# EasyEDA schematic 1-Schematic_simple_slew_limiter.json
TITLE: Sheet_1; REV: 1.0; Date: 2025-02-18; Sheet: 1/1; Drawn By: t.friedrich-soehner; Company: Your Company
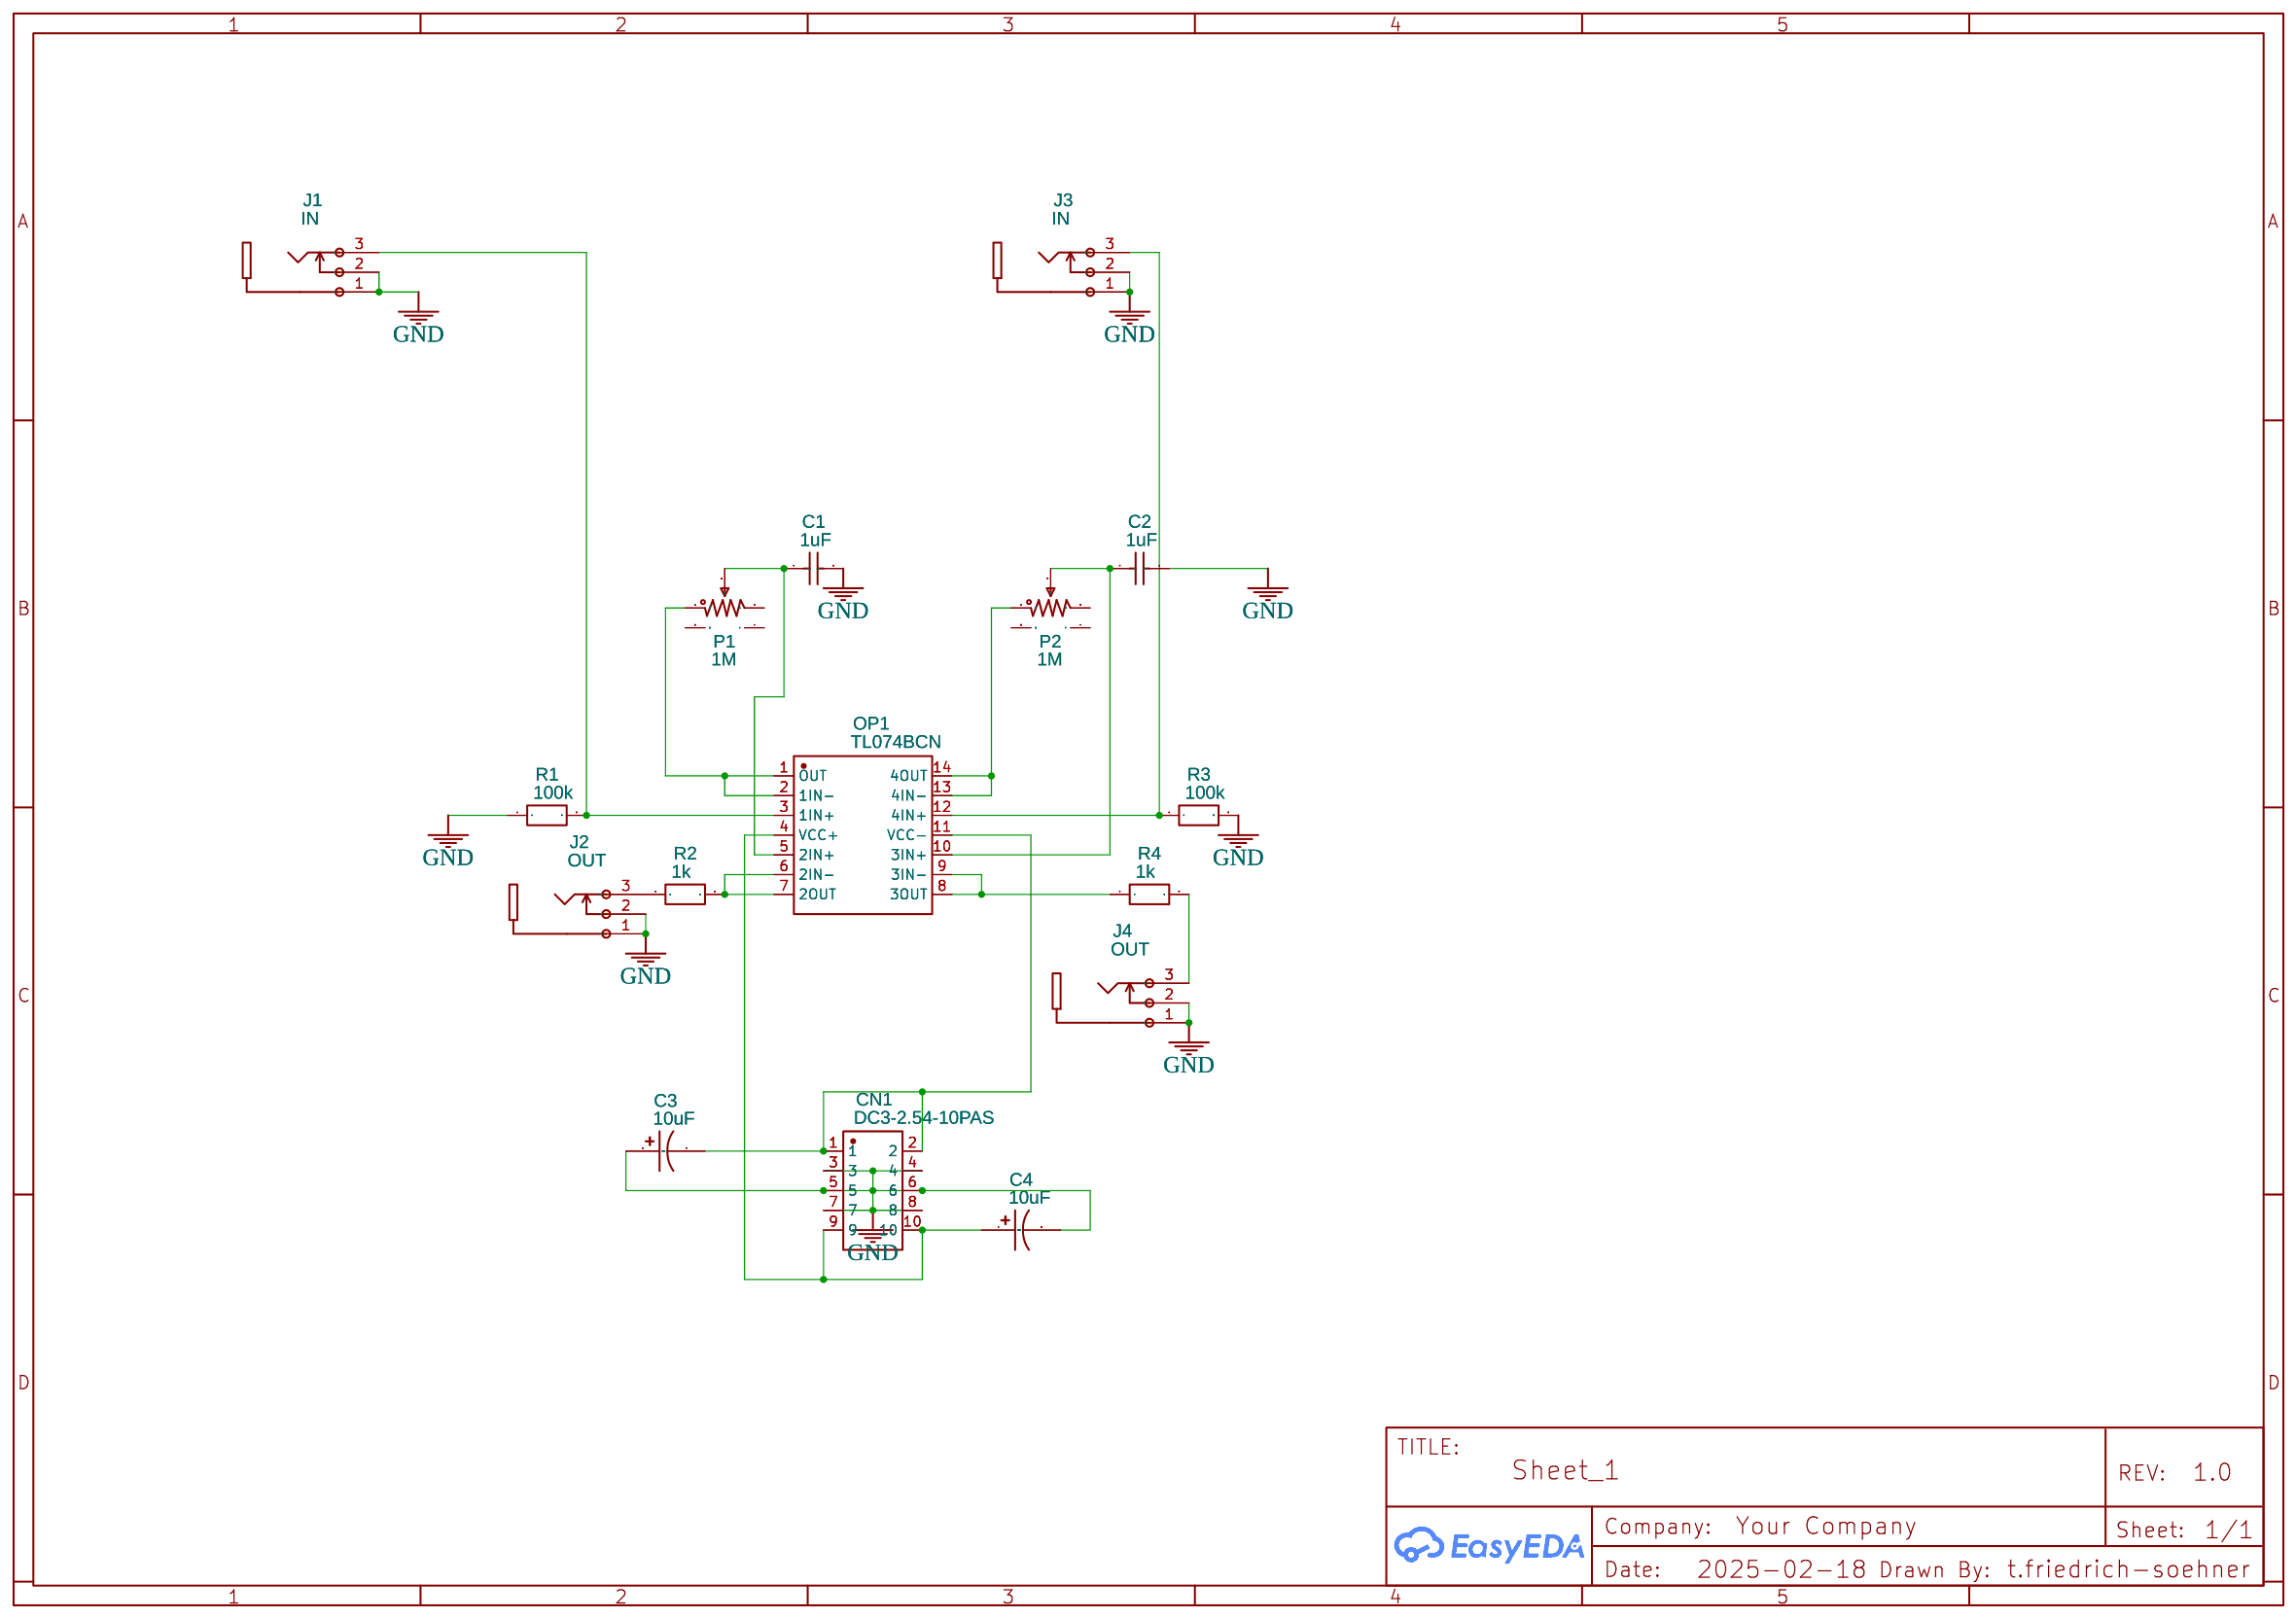
[diagram p0: schematic sheet]

## Parts
C1  1uF  [CAP-2.5*6.5*7.2]
C2  1uF  [CAP-2.5*6.5*7.2]
C3  10uF  [CAP-TH_BD5.0-P2.00-D0.5-FD]
C4  10uF  [CAP-TH_BD5.0-P2.00-D0.5-FD]
CN1  DC3-2.54-10PAS  [CONN-TH_10P-P2.54_DC3-2.54-10PAS]
J1  IN  [PJ-301M]
J2  OUT  [PJ-301M]
J3  IN  [PJ-301M]
J4  OUT  [PJ-301M]
OP1  TL074BCN  [PDIP-14_L19.3-W6.5-P2.54-LS7.6-BL]
P1  1M  [RES-TH_RK09K1130AAU]
P2  1M  [RES-TH_RK09K1130AAU]
R1  100k  [RES-TH_BD2.4-L6.3-P10.30-D0.6]
R2  1k  [RES-TH_BD2.4-L6.3-P10.30-D0.6]
R3  100k  [RES-TH_BD2.4-L6.3-P10.30-D0.6]
R4  1k  [RES-TH_BD2.4-L6.3-P10.30-D0.6]

## Library data of the parts
C1 C2 = 0.22uF 5% 100VCalibration capacitor: Supplier Part: undefined; Supplier: LCSC; Manufacturer: ReliaPro
C3 C4 = 50MS710MEFCTZ5X7: Contributor: lcsc; Supplier: LCSC; Supplier Part: C5115261; Manufacturer: rubycon(红宝石)
CN1 = DC3-2.54-10PAS: Contributor: lcsc; Supplier: LCSC; Supplier Part: C2977596; Manufacturer: ZHOURI(洲日); JLCPCB Part Class: Extended Part
J1-J4 = PJ-301M: Supplier: Various; Contributor: Ed Random
OP1 = TL074BCN: Contributor: LCSC; Supplier: LCSC; Supplier Part: C1346542; Manufacturer: TI(德州仪器); JLCPCB Part Class: Extended Part
P1 P2 = RK09K1130081: Supplier: LCSC; Supplier Part: C470311; Manufacturer: ALPSALPINE(阿尔卑斯阿尔派); JLCPCB Part Class: Extended Part; Contributor: lcsc
R1-R4 = Res_AXIAL-0.4(1/4W)_US

## Nets
GND: C1.2 C2.2 C3.1 C4.2 CN1.3 CN1.4 CN1.5 CN1.6 CN1.7 CN1.8 J1.1 J1.2 J2.1 J2.2 J3.1 J3.2 J4.1 J4.2 R1.1 R3.2
Net-(C1-1): C1.1 OP1.5(2IN+) P1.2
Net-(C2-1): C2.1 OP1.10(3IN+) P2.2
Net-(C3-2): C3.2 CN1.1 CN1.2 OP1.11(VCC-)
Net-(C4-1): C4.1 CN1.9 CN1.10 OP1.4(VCC+)
Net-(J1-3): J1.3 OP1.3(1IN+) R1.2
Net-(J2-3): J2.3 R2.1
Net-(J3-3): J3.3 OP1.12(4IN+) R3.1
Net-(J4-3): J4.3 R4.2
Net-(OP1-1): OP1.1(OUT) OP1.2(1IN-) P1.1
Net-(OP1-6): OP1.6(2IN-) OP1.7(2OUT) R2.2
Net-(OP1-8): OP1.8(3OUT) OP1.9(3IN-) R4.1
Net-(OP1-13): OP1.13(4IN-) OP1.14(4OUT) P2.1

Not connected (* = marked no-connect by the designer): P1 3 4 5; P2 3 4 5
